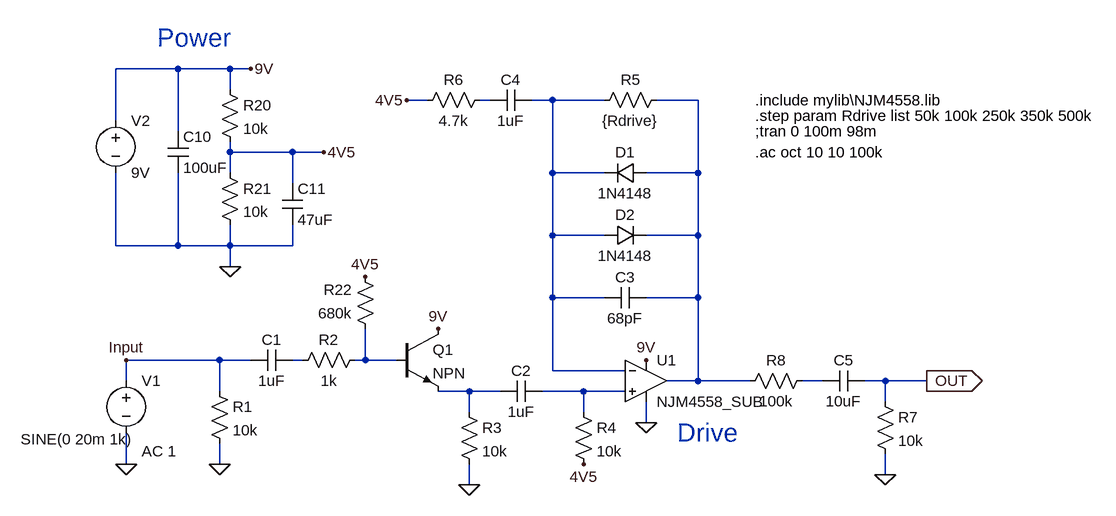
[diagram p0: schematic Tube_Screamer_3.asc]
Tube_Screamer_3.asc, the LTspice schematic file:
Version 4
SHEET 1 2708 1284
WIRE 192 -336 96 -336
WIRE 272 -336 192 -336
WIRE 304 -336 272 -336
WIRE 272 -304 272 -336
WIRE 576 -288 544 -288
WIRE 672 -288 656 -288
WIRE 768 -288 736 -288
WIRE 848 -288 768 -288
WIRE 992 -288 928 -288
WIRE 96 -256 96 -336
WIRE 192 -240 192 -336
WIRE 272 -208 272 -224
WIRE 368 -208 272 -208
WIRE 416 -208 368 -208
WIRE 272 -176 272 -208
WIRE 768 -176 768 -288
WIRE 848 -176 768 -176
WIRE 992 -176 992 -288
WIRE 992 -176 912 -176
WIRE 368 -160 368 -208
WIRE 768 -80 768 -176
WIRE 848 -80 768 -80
WIRE 992 -80 992 -176
WIRE 992 -80 912 -80
WIRE 96 -64 96 -176
WIRE 192 -64 192 -176
WIRE 192 -64 96 -64
WIRE 272 -64 272 -96
WIRE 272 -64 192 -64
WIRE 368 -64 368 -96
WIRE 368 -64 272 -64
WIRE 272 -32 272 -64
WIRE 768 16 768 -80
WIRE 848 16 768 16
WIRE 992 16 992 -80
WIRE 992 16 912 16
WIRE 256 112 112 112
WIRE 304 112 256 112
WIRE 384 112 368 112
WIRE 480 112 480 64
WIRE 480 112 464 112
WIRE 528 112 480 112
WIRE 768 128 768 16
WIRE 880 128 768 128
WIRE 112 144 112 112
WIRE 992 144 992 16
WIRE 992 144 944 144
WIRE 1072 144 992 144
WIRE 1184 144 1152 144
WIRE 1280 144 1248 144
WIRE 1344 144 1280 144
WIRE 256 160 256 112
WIRE 640 160 592 160
WIRE 688 160 640 160
WIRE 816 160 752 160
WIRE 880 160 816 160
WIRE 1280 176 1280 144
WIRE 640 192 640 160
WIRE 816 192 816 160
WIRE 912 208 912 176
WIRE 112 272 112 224
WIRE 256 272 256 240
WIRE 1280 288 1280 256
WIRE 640 304 640 272
FLAG 112 272 0
FLAG 256 272 0
FLAG 640 304 0
FLAG 912 208 0
FLAG 816 272 4V5
FLAG 592 64 9V
FLAG 912 112 9V
FLAG 416 -208 4V5
FLAG 272 -32 0
FLAG 304 -336 9V
FLAG 480 -16 4V5
FLAG 112 112 Input
FLAG 544 -288 4V5
FLAG 1280 288 0
FLAG 1344 144 OUT
IOPIN 1344 144 Out
SYMBOL voltage 112 128 R0
WINDOW 123 24 124 Left 2
WINDOW 39 0 0 Left 2
WINDOW 3 -162 106 Left 2
SYMATTR Value2 AC 1
SYMATTR InstName V1
SYMATTR Value SINE(0 20m 1k)
SYMBOL res 240 144 R0
SYMATTR InstName R1
SYMATTR Value 10k
SYMBOL cap 368 96 R90
WINDOW 0 0 32 VBottom 2
WINDOW 3 32 32 VTop 2
SYMATTR InstName C1
SYMATTR Value 1uF
SYMBOL res 480 96 R90
WINDOW 0 0 56 VBottom 2
WINDOW 3 32 56 VTop 2
SYMATTR InstName R2
SYMATTR Value 1k
SYMBOL npn 528 64 R0
SYMATTR InstName Q1
SYMBOL res 624 176 R0
SYMATTR InstName R3
SYMATTR Value 10k
SYMBOL cap 752 144 R90
WINDOW 0 0 32 VBottom 2
WINDOW 3 32 32 VTop 2
SYMATTR InstName C2
SYMATTR Value 1uF
SYMBOL res 800 176 R0
SYMATTR InstName R4
SYMATTR Value 10k
SYMBOL Opamps\\opamp2 912 80 R0
SYMATTR InstName U1
SYMATTR Value NJM4558_SUB
SYMBOL cap 912 0 R90
WINDOW 0 0 32 VBottom 2
WINDOW 3 32 32 VTop 2
SYMATTR InstName C3
SYMATTR Value 68pF
SYMBOL diode 912 -160 M270
WINDOW 0 32 32 VTop 2
WINDOW 3 0 32 VBottom 2
SYMATTR InstName D1
SYMATTR Value 1N4148
SYMBOL diode 848 -64 R270
WINDOW 0 32 32 VTop 2
WINDOW 3 0 32 VBottom 2
SYMATTR InstName D2
SYMATTR Value 1N4148
SYMBOL res 944 -304 R90
WINDOW 0 0 56 VBottom 2
WINDOW 3 32 56 VTop 2
SYMATTR InstName R5
SYMATTR Value {Rdrive}
SYMBOL cap 736 -304 R90
WINDOW 0 0 32 VBottom 2
WINDOW 3 32 32 VTop 2
SYMATTR InstName C4
SYMATTR Value 1uF
SYMBOL res 672 -304 R90
WINDOW 0 0 56 VBottom 2
WINDOW 3 32 56 VTop 2
SYMATTR InstName R6
SYMATTR Value 4.7k
SYMBOL voltage 96 -272 R0
WINDOW 123 0 0 Left 2
WINDOW 39 0 0 Left 2
SYMATTR InstName V2
SYMATTR Value 9V
SYMBOL res 256 -320 R0
SYMATTR InstName R20
SYMATTR Value 10k
SYMBOL res 256 -192 R0
SYMATTR InstName R21
SYMATTR Value 10k
SYMBOL res 496 80 R180
WINDOW 0 36 76 Left 2
WINDOW 3 36 40 Left 2
SYMATTR InstName R22
SYMATTR Value 680k
SYMBOL cap 176 -240 R0
SYMATTR InstName C10
SYMATTR Value 100uF
SYMBOL cap 352 -160 R0
SYMATTR InstName C11
SYMATTR Value 47uF
SYMBOL cap 1248 128 R90
WINDOW 0 0 32 VBottom 2
WINDOW 3 32 32 VTop 2
SYMATTR InstName C5
SYMATTR Value 10uF
SYMBOL res 1264 160 R0
SYMATTR InstName R7
SYMATTR Value 10k
SYMBOL res 1168 128 R90
WINDOW 0 0 56 VBottom 2
WINDOW 3 32 56 VTop 2
SYMATTR InstName R8
SYMATTR Value 100k
TEXT 960 224 Left 4 ;Drive
TEXT 160 -384 Left 4 ;Power
TEXT 1080 -288 Left 2 !.include mylib\\NJM4558.lib
TEXT 1080 -264 Left 2 !.step param Rdrive list 50k 100k 250k 350k 500k
TEXT 1080 -240 Left 2 !;tran 0 100m 98m
TEXT 1080 -208 Left 2 !.ac oct 10 10 100k

The netlist it stands for:
* Tube_Screamer_3.asc
V1 Input 0 SINE(0 20m 1k) AC 1
R1 Input 0 10k
C1 N004 Input 1uF
R2 N005 N004 1k
Q1 9V N005 N007 0 NPN
R3 N007 0 10k
C2 N008 N007 1uF
R4 N008 4V5 10k
XU1 N008 N002 9V 0 N003 NJM4558_SUB  ; pins In+ In- V+ V- OUT
C3 N003 N002 68pF
D1 N003 N002 1N4148
D2 N002 N003 1N4148
R5 N003 N002 {Rdrive}
C4 N002 N001 1uF
R6 N001 4V5 4.7k
V2 9V 0 9V
R20 9V 4V5 10k
R21 4V5 0 10k
R22 N005 4V5 680k
C10 9V 0 100uF
C11 4V5 0 47uF
C5 OUT N006 10uF
R7 OUT 0 10k
R8 N006 N003 100k
.model D D
.lib standard.dio
.model NPN NPN
.model PNP PNP
.lib standard.bjt
* Drive
* Power
.include mylib\NJM4558.lib
.step param Rdrive list 50k 100k 250k 350k 500k
;tran 0 100m 98m
.ac oct 10 10 100k
.backanno
.end